# Altium project HierarchicalModeling.PrjPcb
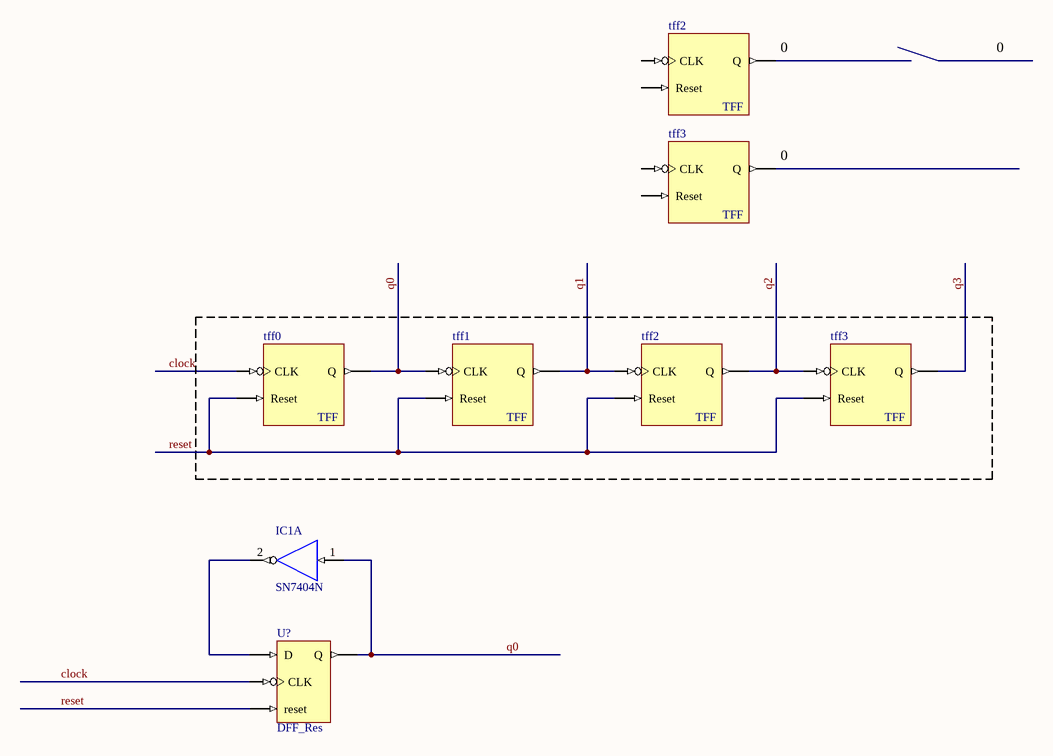
[diagram p0: HierarchicalModeling.SchDoc]
1 sheet, 8 parts. Net scope: global (net labels, ports and power ports of the same name join across sheets).

## Sheet HierarchicalModeling.SchDoc
size A4

### Parts
(Parts that share a designator on the sheet are numbered #1, #2 ... from top to bottom, then left to right.)
IC1  SN7404N  [N014]  (part A of 6)
tff0  TFF
tff1  TFF
tff2#1  TFF
tff2#2  TFF
tff3#1  TFF
tff3#2  TFF
U?  DFF_Res

### Nets
GND: IC1.7(GND)
VCC: IC1.14(VCC)
clock: tff0.CLK U?.CLK
q0: IC1.1(A) tff0.Q tff1.CLK U?.Q
q1: tff1.Q tff2#2.CLK
q2: tff2#2.Q tff3#2.CLK
q3: tff3#2.Q
reset: tff0.Reset tff1.Reset tff2#2.Reset tff3#2.Reset U?.reset
NetIC1_2: IC1.2(Y) U?.D

Not connected (* = marked no-connect by the designer): tff2#1 CLK Q Reset; tff3#1 CLK Q Reset

### Notes on the sheet
- (near tff2#1) 0
- 0
- (near tff3#1) 0

### Library data of the parts
IC1 = SN7404N: Hex Inverter; Published: 8-Jun-2000; LatestRevisionDate: 04-Mar-2005; LatestRevisionNote: Stylized 3D Model Added.; DatasheetVersion: Mar-1988; PackageVersion: Oct-1995; PackageReference: N014; Publisher: Altium Limited; PackageDescription: DIP; 14 Leads; Row Spacing 7.62 mm; Pitch 2.54 mm; ComponentLink1Description: Manufacturer Link; ComponentLink1URL: http://www.ti.com/; ComponentLink2Description: Datasheet; ComponentLink2URL: http://www-s.ti.com/sc/ds/sn5404.pdf; ComponentLink3Description: Packaging Specification; ComponentLink3URL: http://focus.ti.com/lit/ml/mpdi002c/mpdi002c.pdf
tff0 tff1 tff2#1 tff2#2 tff3#1 tff3#2 = TFF: Positive Edge Triggered D-Type Flip-Flop
U? = DFF_Res: Positive Edge Triggered D-Type Flip-Flop; FPGAVendor: Actel; Published: 21-Jul-2004; Publisher: Altium Limited; HelpURL: http://www.actel.com/documents/PA_libguide.pdf